# Altium schematic sheet 5V0_SYS_SUPPLY.SchDoc
size OrCAD B; SheetNumber: 4; SheetTotal: 13
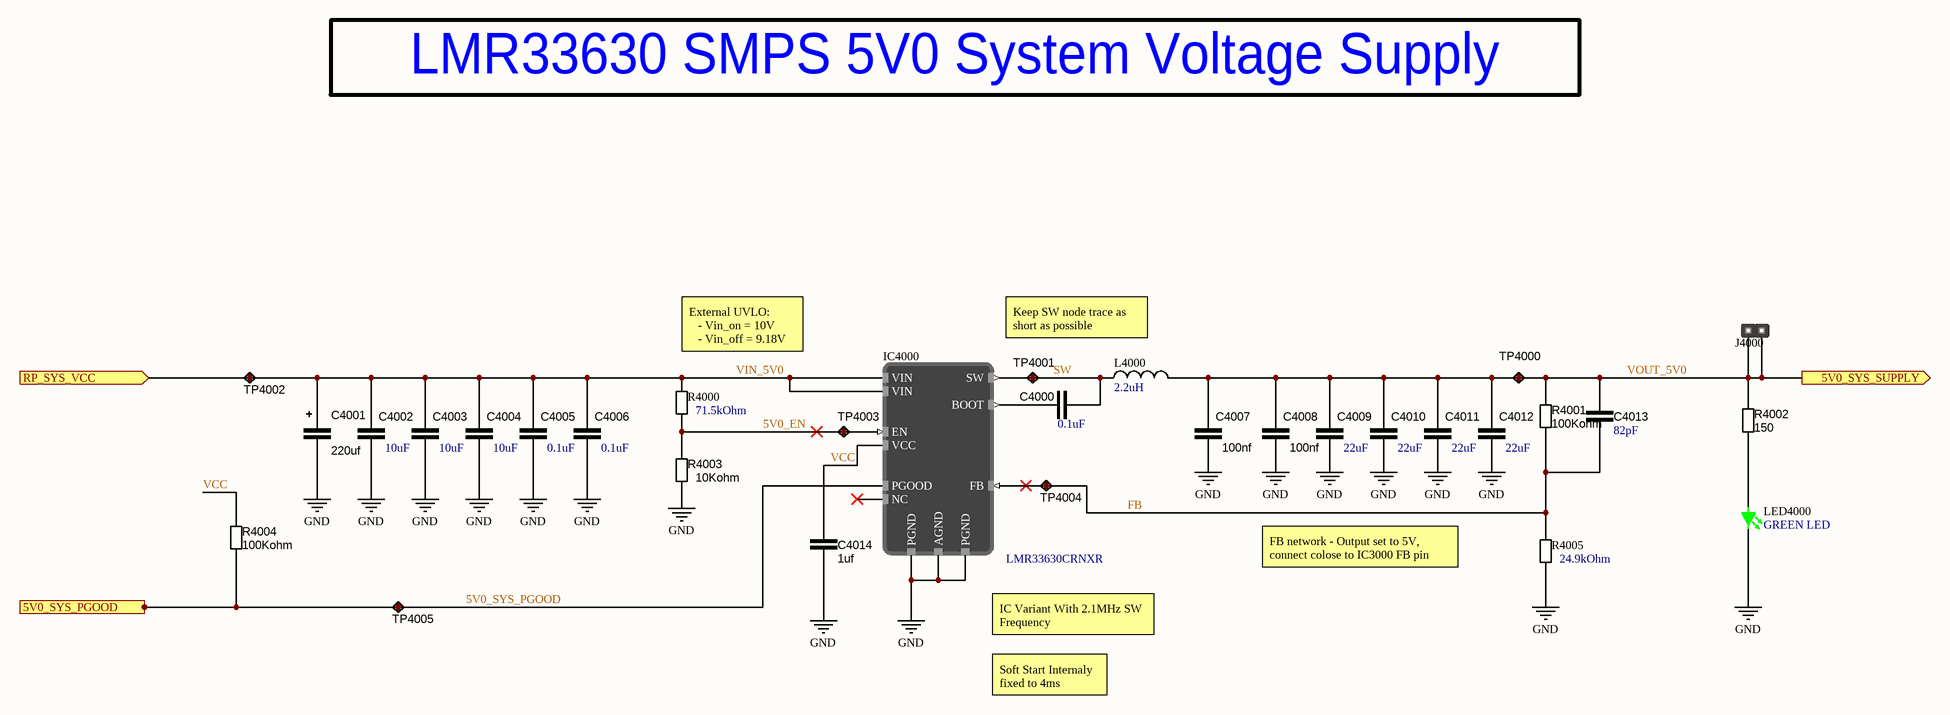
[diagram p0: 5V0_SYS_SUPPLY.SchDoc]

## Parts
C4000  0.1uF  [CAP_0603]
C4001  220uf  [CAPAE109103X103M]
C4002  10uF  [CAP_1206]
C4003  10uF  [CAP_1206]
C4004  10uF  [CAP_1206]
C4005  0.1uF  [CAP_0603]
C4006  0.1uF  [CAP_0603]
C4007  100nf  [CAP_0603]
C4008  100nf  [CAP_0603]
C4009  22uF  [CAP_1206]
C4010  22uF  [CAP_1206]
C4011  22uF  [CAP_1206]
C4012  22uF  [CAP_1206]
C4013  82pF  [CAP_0603]
C4014  1uf  [CAP_0603]
IC4000  LMR33630CRNXR  [VQFN-HR]
J4000  *  [HM1x2]  (value not drawn)
L4000  2.2uH  [INDP_518X518]
LED4000  GREEN LED  [DIOC1608X04N]
R4000  71.5kOhm  [RES_0603]
R4001  100Kohm  [RES_0603]
R4002  150  [RES_0603]
R4003  10Kohm  [RES_0603]
R4004  100Kohm  [RES_0603]
R4005  24.9kOhm  [RES_0603]
TP4000  Test point  [TestPoint]  (value not drawn)
TP4001  Test point  [TestPoint]  (value not drawn)
TP4002  Test point  [TestPoint]  (value not drawn)
TP4003  Test point  [TestPoint]  (value not drawn)
TP4004  Test point  [TestPoint]  (value not drawn)
TP4005  Test point  [TestPoint]  (value not drawn)

## Ports
5V0_SYS_PGOOD (out, see Power[2B]), 5V0_SYS_SUPPLY (out, see Power[3B]), RP_SYS_VCC (in, see Power[2B])

## Nets
GND: C4001.1 C4002.1 C4003.1 C4004.1 C4005.1 C4006.1 C4007.1 C4008.1 C4009.1 C4010.1 C4011.1 C4012.1 C4014.1 IC4000.1(PGND) IC4000.6(AGND) IC4000.11(PGND) LED4000.2 R4003.1 R4005.1
5V0_EN: IC4000.9(EN) R4000.1 R4003.2 TP4003.1
5V0_SYS_PGOOD: IC4000.8(PGOOD) R4004.1 TP4005.1 ; port 5V0_SYS_PGOOD
FB: C4013.1 IC4000.7(FB) R4001.1 R4005.2 TP4004.1
SW: C4000.2 IC4000.12(SW) L4000.1 TP4001.1
VCC: C4014.2 IC4000.5(VCC) R4004.2
VIN_5V0: C4001.2 C4002.2 C4003.2 C4004.2 C4005.2 C4006.2 IC4000.2(VIN) IC4000.10(VIN) R4000.2 TP4002.1 ; port RP_SYS_VCC
VOUT_5V0: C4007.2 C4008.2 C4009.2 C4010.2 C4011.2 C4012.2 C4013.2 J4000.1 J4000.2 L4000.2 R4001.2 R4002.2 TP4000.1 ; port 5V0_SYS_SUPPLY
NetC4000_1: C4000.1 IC4000.4(BOOT)
NetLED4000_1: LED4000.1 R4002.1

Not connected (* = marked no-connect by the designer): IC4000 3(NC)*

## Notes on the sheet
- LMR33630 SMPS 5V0 System Voltage Supply
- (near R4000) External UVLO:
  - Vin_on = 10V
  - Vin_off = 9.18V
- Keep SW node trace as short as possible
- FB network - Output set to 5V, connect colose to IC3000 FB pin
- (near IC4000) IC Variant With 2.1MHz SW Frequency
- Soft Start Internaly fixed to 4ms

## Library data of the parts
C4000 C4005 C4006 = C000018: CAP CER 0.1UF 50V X7R 0603; capacitance: 0.1uF; ComponentLink1Description: DigiKey; ComponentLink1URL: https://www.digikey.com/en/products/detail/samsung-electro-mechanics/CL10B104KB8NNNC/3886658; DigiKey Part Number: 1276-1000-1-ND
C4001 = C000019: CAP ALUM 220UF 20% 50V SMD; capaticanse: 220uf; ComponentLink1Description: digikey; ComponentLink1URL: https://www.digikey.com/en/products/detail/nichicon/UCW1H221MNL1GS/2549783; DigiKey part number: 493-9426-1-ND
C4002-C4004 = C000017: CAP CER 10UF 50V X7R 1206; capacitance: 10uF; ComponentLink1Description: DigiKey; ComponentLink1URL: https://www.digikey.com/en/products/detail/samsung-electro-mechanics/CL31B106KBHNNNE/5961251; DigiKey Part Number: 1276-6767-1-ND
C4007 C4008 = C000007: CAP CER 100nF 0603 25V X7R; capaticanse: 100nf; ComponentLink1Description: digikey; ComponentLink1URL: https://www.digikey.com/en/products/detail/kyocera-avx/06033C104K4T2A/8019250
C4009-C4012 = C000020: 22 µF ±10% 25V Ceramic Capacitor X5R 1206 (3216 Metric); capacitance: 22uF; ComponentLink1Description: DigiKey; ComponentLink1URL: https://www.digikey.com/en/products/detail/samsung-electro-mechanics/CL31A226KAHNNNE/3888705; DigiKey Part Number: 1276-3047-1-ND
C4013 = C000021: 82 pF ±1% 25V Ceramic Capacitor C0G, NP0 0603 (1608 Metric); capacitance: 82pF; ComponentLink1Description: DigiKey; ComponentLink1URL: https://www.digikey.com/en/products/detail/kyocera-avx/KGM15ACG1E820FT/1599315?s=N4IgjCBcoMxaBjKAzAhgGwM4FMA0IB7KAbXDBggF18AHAFyhAGU6AnASwDsBzEAX3xgALPBBJIaLHkIlwAVgCcAJiEB2ENRD1GLDj36CAbKPGSc%2BIpFIxlQ45u2RmbLrwEglABiEKTKDOYyViAAHEoABDQAYhq0DE4AqpzsdADyyACy2KiYAK6s2AYgALRKfpBsudKWpHIafA1AA; DigiKey Part Number: 478-KGM15ACG1E820FTCT-ND
C4014 = C000011: CAP CER 1uF 10V X7R 0603; capaticanse: 1uf; ComponentLink1Description: digikey; ComponentLink1URL: https://www.digikey.com/en/products/detail/samsung-electro-mechanics/CL10B105KP8NNNC/3887604; DigiKey part number: 1276-1946-2-ND
IC4000 = LMR33630CRNXR: Buck Switching Regulator IC Positive Adjustable 1V 1 Output 3A 12-PowerVFQFN; DigiKey Part Number: 296-49768-1-ND; ComponentLink1Description: DigiKey; ComponentLink1URL: https://www.digikey.com/en/products/detail/texas-instruments/LMR33630CRNXR/9356579; Mouser Part Number: 595-LMR33630CRNXR; ComponentLink2Description: Mouser; ComponentLink2URL: https://eu.mouser.com/ProductDetail/Texas-Instruments/LMR33630CRNXR?qs=55YtniHzbhDkvgzAIyvpfQ%3D%3D
J4000 = HEADER_1x2: Manufacturer Part Number: *
L4000 = L000012: FIXED IND 2.2UH 4.2A 50.1MOHM SM; inductance: 2.2uH; DigiKey Part Number: 541-1088-1-ND; ComponentLink1Description: DigiKey; ComponentLink1URL: https://www.digikey.com/en/products/detail/vishay-dale/IHLP2020BZER2R2M01/1869311?s=N4IgTCBcDaIJIAkAyAFMAGDAhAWgUQCUwiBZdARhAF0BfIA
LED4000 = 00000001: LED GREEN DIFFUSED 0603 SMD; Supplier 1: Avnet; Supplier Part Number 1: Q65111A3964; ComponentLink1Description: Digikey; ComponentLink1URL: https://www.digikey.com/en/products/detail/ams-osram-usa-inc/LG-Q396-PS-35/5249855
R4000 = R000022: 71.5 kOhms ±1% 0.1W, 1/10W Chip Resistor 0603 (1608 Metric) Moisture Resistant Thick Film; ComponentLink1Description: DigiKey; ComponentLink1URL: https://www.digikey.com/en/products/detail/yageo/RC0603FR-0771K5L/727370; resistance: 71.5kOhm; DigiKey Part Number: 311-71.5KHRCT-ND
R4001 R4004 = R000006: RES 100K OHM 1% 1/10W 0603; resistance: 100Kohm; ComponentLink1Description: digikey; ComponentLink1URL: https://www.digikey.com/en/products/detail/stackpole-electronics-inc/RMCF0603FG100K/1713543
R4002 = R000004: RES 150 OHM 1% 1/10W 0603; resistance: 1Kohm; ComponentLink1Description: digikey; ComponentLink1URL: https://www.digikey.com/en/products/detail/vishay-beyschlag-draloric-bc-components/MCT06030C1001FP500/2607821
R4003 = R000001: RES 10K OHM 1% 1/10W 0603; resistance: 10Kohm; ComponentLink1Description: digikey; ComponentLink1URL: https://www.digikey.com/en/products/detail/vishay-beyschlag-draloric-bc-components/MCT06030C1002FP500/1850440
R4005 = R000017: 24.9 kOhms ±1% 0.1W, 1/10W Chip Resistor 0603 (1608 Metric) Automotive AEC-Q200 Thick Film; ComponentLink1Description: DigiKey; ComponentLink1URL: https://www.digikey.com/en/products/detail/panasonic-electronic-components/ERJ-3EKF2492V/196236; resistance: 24.9kOhm; DigiKey Part Number: P24.9KHCT-ND
TP4000-TP4005 = TP002: Test point 1mm